# EAGLE schematic Mock_HASP_Flight_Computer (EAGLE 9.1.1)
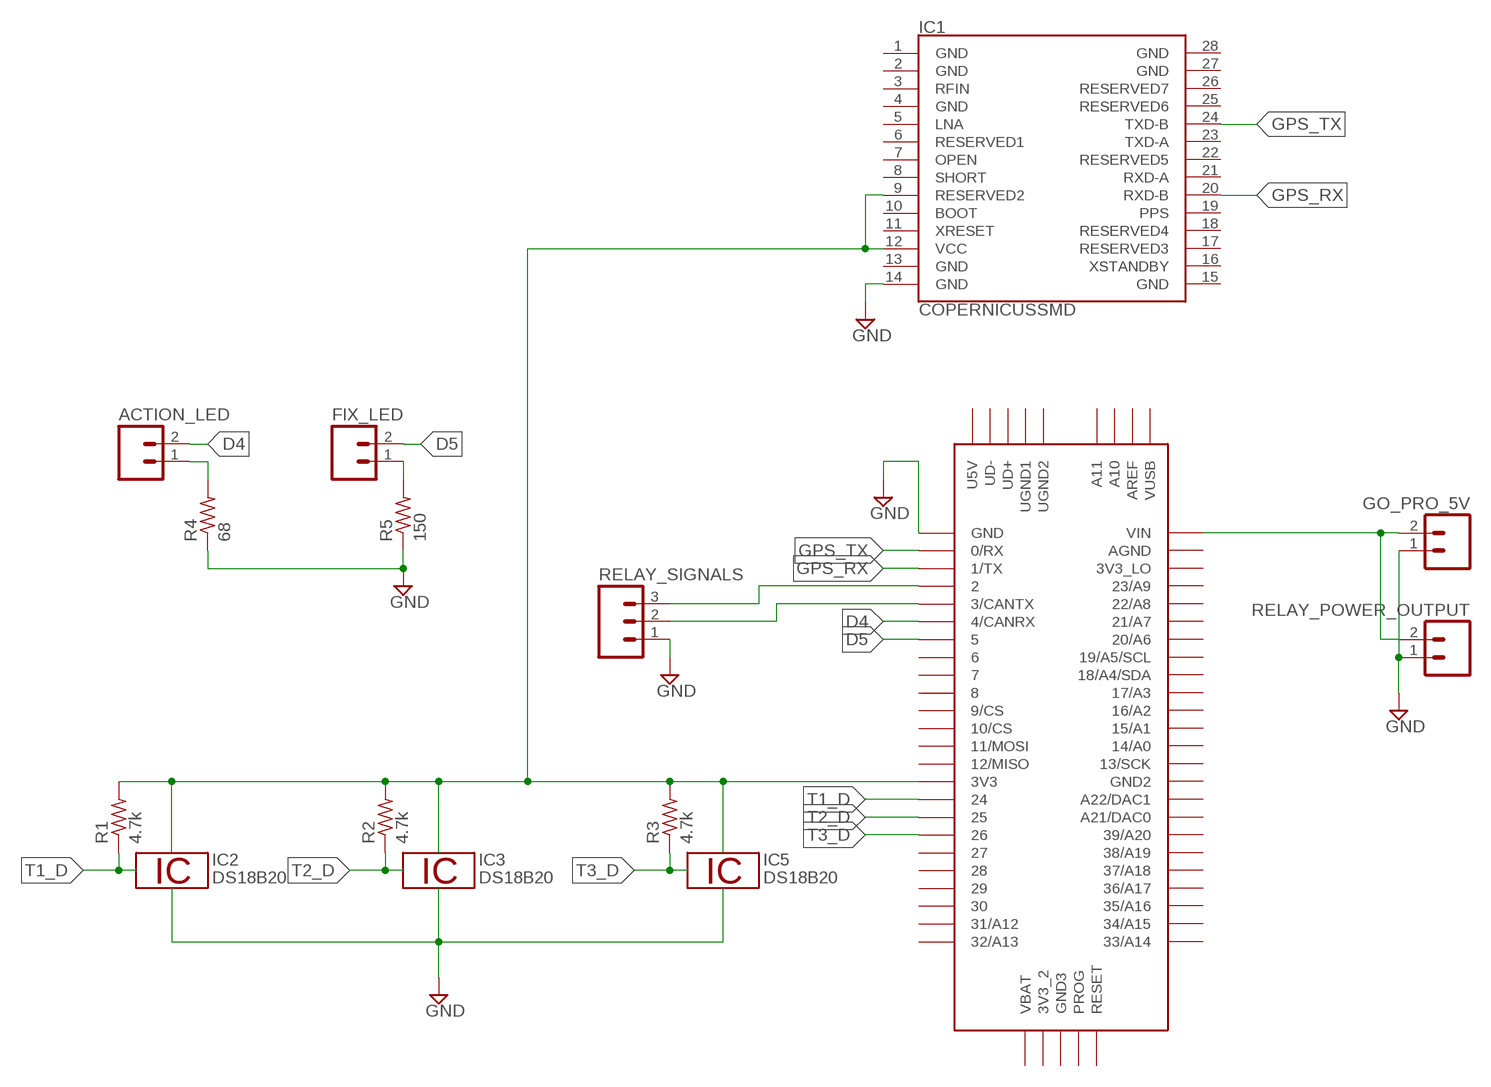
[diagram p0: schematic, sheet 1]

## Parts
ACTION_LED  M02  [02P]
FIX_LED  M02  [02P]
GO_PRO_5V  M02  [02P]
IC1  COPERNICUSSMD  [COPERNICUS]
IC2  DS18B20  [TO92-]
IC3  DS18B20  [TO92-]
IC5  DS18B20  [TO92-]
R1  4.7k  R-US_0207/10  [0207/10]
R2  4.7k  R-US_0207/10  [0207/10]
R3  4.7k  R-US_0207/10  [0207/10]
R4  68  R-US_0207/10  [0207/10]
R5  150  R-US_0207/10  [0207/10]
RELAY_POWER_OUTPUT  M02  [02P]
RELAY_SIGNALS  M03  [03P]
U$1  TEENSY_3.5/3.6  [TEENSY_3.5/3.6]

## Nets
D4: ACTION_LED.2 U$1.4/CANRX
D5: FIX_LED.2 U$1.5
GND: GO_PRO_5V.1 IC1.14(GND) R4.1 R5.1 RELAY_POWER_OUTPUT.1 RELAY_SIGNALS.1 U$1.GND
GPS_RX: IC1.20(RXD-B) U$1.1/TX
GPS_TX: IC1.24(TXD-B) U$1.0/RX
N$1: IC1.9(RESERVED2) IC1.12(VCC) R1.2 R2.2 R3.2 U$1.3V3
N$2: RELAY_SIGNALS.3 U$1.2
N$3: RELAY_SIGNALS.2 U$1.3/CANTX
N$4: ACTION_LED.1 R4.2
N$5: GO_PRO_5V.2 RELAY_POWER_OUTPUT.2 U$1.VIN
N$6: FIX_LED.1 R5.2
T1_D: R1.1 U$1.24
T2_D: R2.1 U$1.25
T3_D: R3.1 U$1.26
Unconnected: IC1.1(GND) IC1.2(GND) IC1.3(RFIN) IC1.4(GND) IC1.5(LNA) IC1.6(RESERVED1) IC1.7(OPEN) IC1.8(SHORT) IC1.10(BOOT) IC1.11(XRESET) IC1.13(GND) IC1.15(GND) IC1.16(XSTANDBY) IC1.17(RESERVED3) IC1.18(RESERVED4) IC1.19(PPS) IC1.21(RXD-A) IC1.22(RESERVED5) IC1.23(TXD-A) IC1.25(RESERVED6) IC1.26(RESERVED7) IC1.27(GND) IC1.28(GND) U$1.3V3_2 U$1.3V3_LO U$1.6 U$1.7 U$1.8 U$1.9/CS U$1.10/CS U$1.11/MOSI U$1.12/MISO U$1.13/SCK U$1.14/A0 U$1.15/A1 U$1.16/A2 U$1.17/A3 U$1.18/A4/SDA U$1.19/A5/SCL U$1.20/A6 U$1.21/A7 U$1.21/DAC0(A21/DAC0) U$1.22/A8 U$1.23/A9 U$1.27 U$1.28 U$1.29 U$1.30 U$1.31/A12 U$1.32/A13 U$1.33/A14 U$1.34/A15 U$1.35/A16 U$1.36/A17 U$1.37/A18 U$1.38/A19 U$1.39/A20 U$1.A10 U$1.A11 U$1.A22/DAC1 U$1.AGND U$1.AREF U$1.GND2 U$1.GND3 U$1.PROG U$1.RESET U$1.U5V U$1.UD+ U$1.UD- U$1.UGND1 U$1.UGND2 U$1.VBAT U$1.VUSB

## Power pins joined to a net without a drawn wire
1W: IC2.2 IC3.2 IC5.2
GND: IC2.1 IC3.1 IC5.1
VDD: IC2.3 IC3.3 IC5.3

## Library data of the parts
ACTION_LED FIX_LED GO_PRO_5V RELAY_POWER_OUTPUT = con-amp-quick:M02: AMP QUICK CONNECTOR; OC_FARNELL: unknown; OC_NEWARK: unknown
IC1 = SparkFun-GPS:COPERNICUS: Trimble Copernicus II GPS Receiver The Trimble Copernicus II delivers proven performance and Trimble quality for a new generation of position-enabled products. It features the TrimCore™ navigation software for extremely fast startup times and high performance in foliage canopy and urban canyon environments. SparkFun Products GPS Module - Copernicus II (12 Channel) <https://www.sparkfun.com/products/10922> (GPS-10922) SparkFun GPS Module - Copernicus II DIP (12 Channel) <https://www.sparkfun.com/products/11858> (GPS-11858); PROD_ID: GPS-10735; SF_ID: GPS-10922
IC2 IC3 IC5 = 1wire:DS18B20: Programmable Resolution Digital Thermometer This chip provides a onewire thermosensor with approx. 0.5°C accuracy. A programmable over/undertemperure alarm is available. The precision can be set from 9..12 bits. Notes: Vdd must be applied for accurate measurements at low temperatures, as the parasite power circuit otherwise heats the sensor. If parasite power is used, Vdd has to be connected to GND. The DS1822 is a low-cost thermometer chip, the DS18S20 is similar to the DS18B20, but with 9 Bit precision only. Author: Jan Kandziora <jjj@gmx.de>
R1-R5 = resistor:R-US_: RESISTOR, American symbol
RELAY_SIGNALS = con-amp-quick:M03: AMP QUICK CONNECTOR; OC_FARNELL: unknown; OC_NEWARK: unknown
U$1 = Teensy356:TEENSY_3.5/3.6